# EAGLE design RasPiDV (EAGLE 6.4)
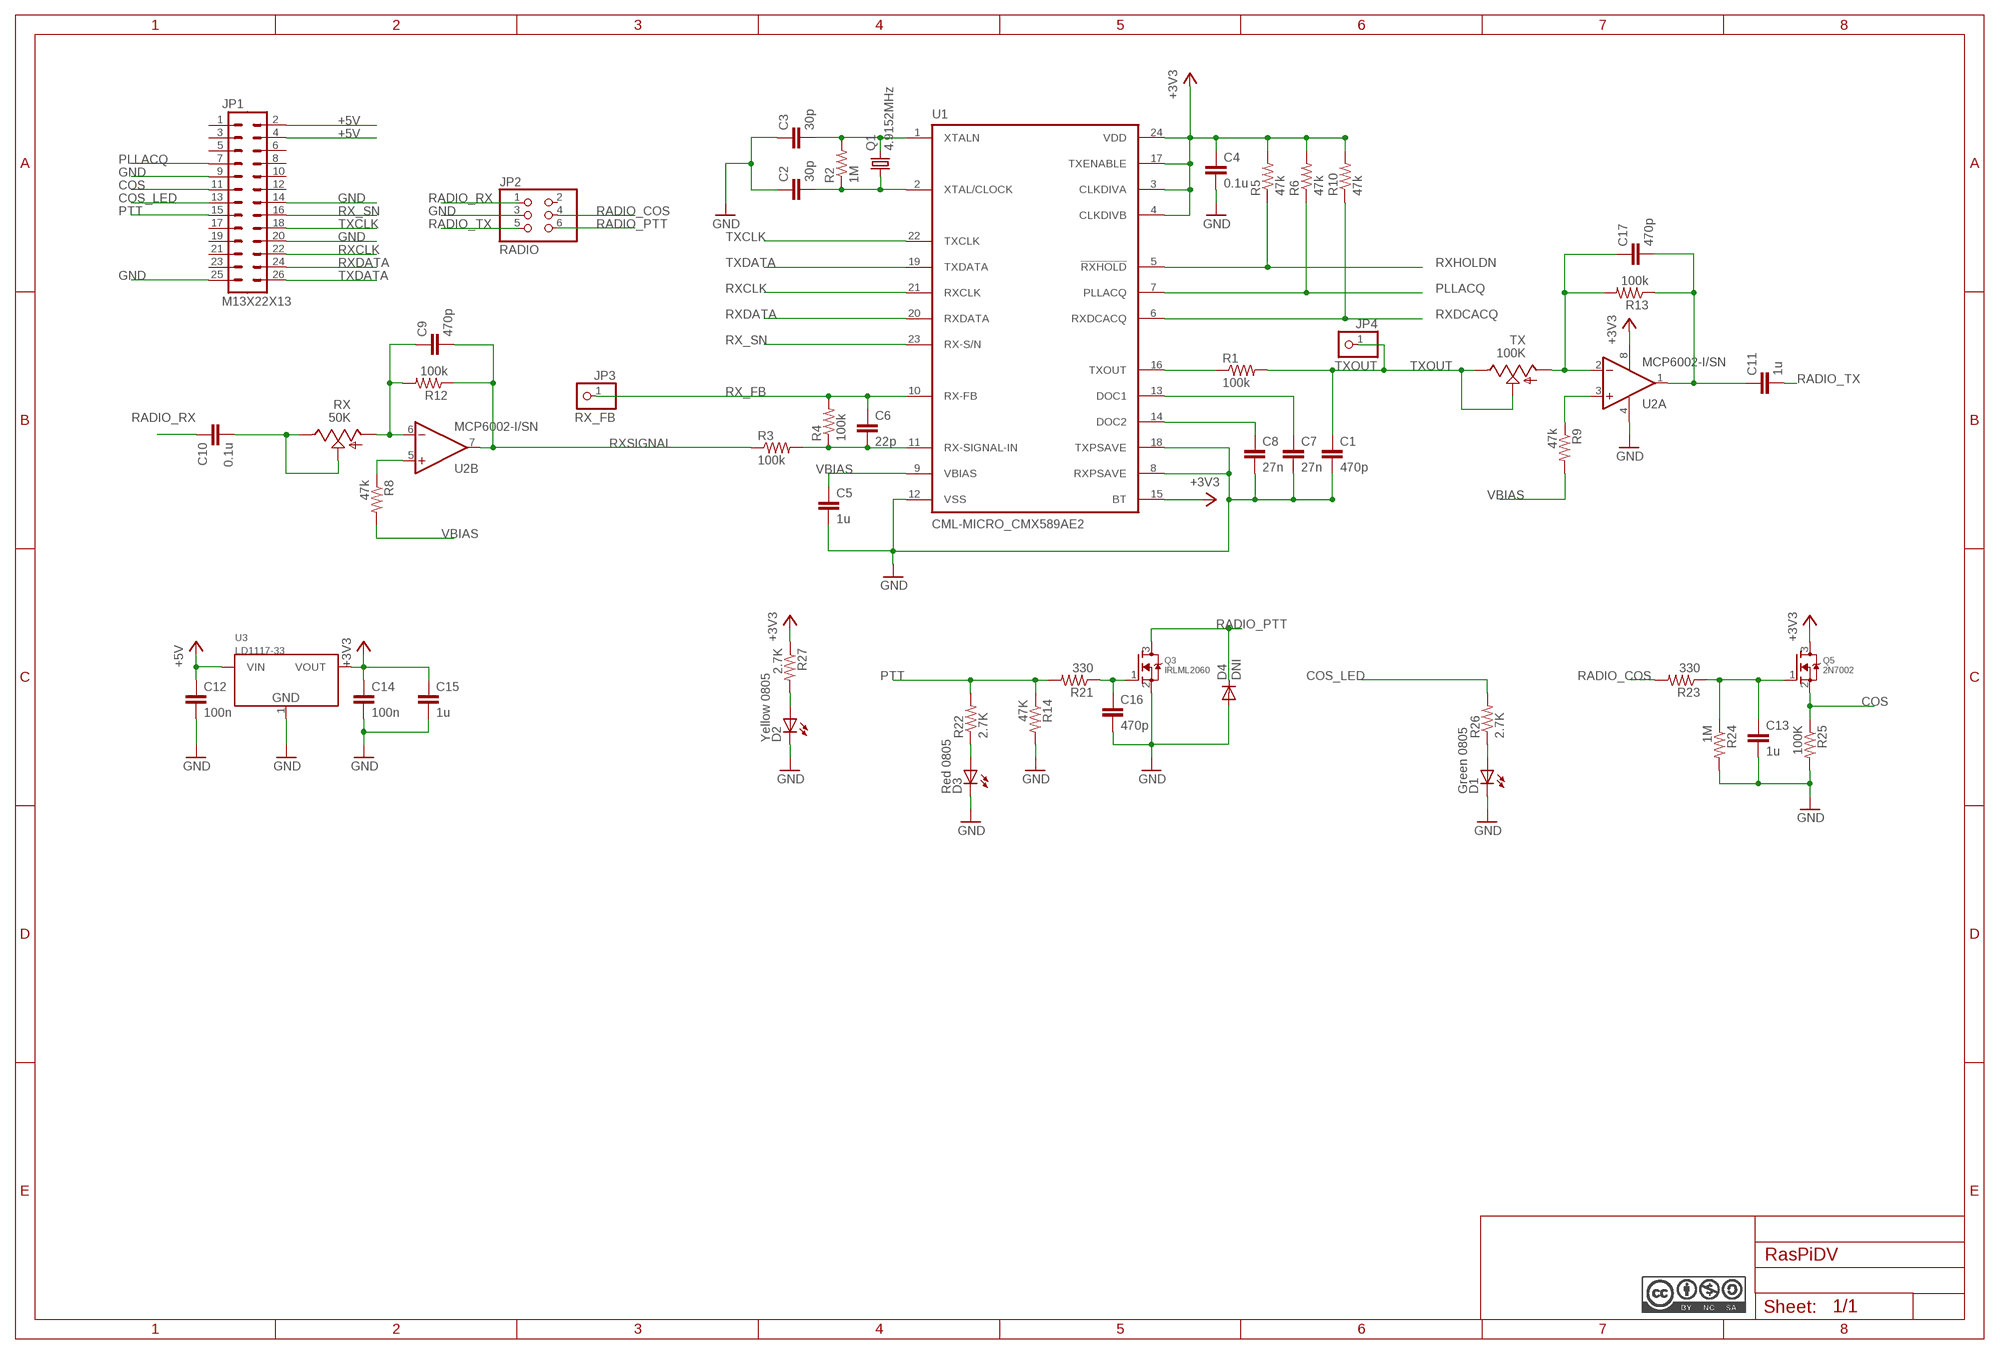
[diagram p0: schematic, sheet 1]

## Parts
C1  470p  C-EUC0805  [C0805]
C2  30p  C-EUC0805  [C0805]
C3  30p  C-EUC0805  [C0805]
C4  0.1u  C-EUC0805  [C0805]
C5  1u  C-EUC0805  [C0805]
C6  22p  C-EUC0805  [C0805]
C7  27n  C-EUC0805  [C0805]
C8  27n  C-EUC0805  [C0805]
C9  470p  C-EUC0805  [C0805]
C10  0.1u  C-EUC0805  [C0805]
C11  1u  C-EUC0805  [C0805]
C12  100n  C-EUC0805  [C0805]
C13  1u  C-EUC0805  [C0805]
C14  100n  C-EUC0805  [C0805]
C15  1u  C-EUC0805  [C0805]
C16  470p  C-EUC0805  [C0805]
C17  470p  C-EUC0805  [C0805]
D1  Green 0805  LEDCHIPLED_0805  [CHIPLED_0805]
D2  Yellow 0805  LEDCHIPLED_0805  [CHIPLED_0805]
D3  Red 0805  LEDCHIPLED_0805  [CHIPLED_0805]
D4  DNI  DIODE-MICROMELF-R  [MICROMELF-R]
JP1  M13X22X13  [2X13]
JP2  RADIO  HEADER-2X3  [2X03_ROUND_70MIL]
JP3  RX_FB  HEADER-1X1ROUND  [1X01_ROUND]
JP4  TXOUT  HEADER-1X1ROUND  [1X01_ROUND]
Q1  4.9152MHz  CRYSTAL_CRYSTALHC49S  [CRYSTAL_HC49/S]
Q3  IRLML2060  MOSFET-NREFLOW  [SOT23]
Q5  2N7002  MOSFET-NREFLOW  [SOT23-R]
R1  100k  R-US_R0805W  [R0805W]
R2  1M  R-US_R0805W  [R0805W]
R3  100k  R-US_R0805W  [R0805W]
R4  100k  R-US_R0805W  [R0805W]
R5  47k  R-US_R0805W  [R0805W]
R6  47k  R-US_R0805W  [R0805W]
R8  47k  R-US_R0805W  [R0805W]
R9  47k  R-US_R0805W  [R0805W]
R10  47k  R-US_R0805W  [R0805W]
R12  100k  R-US_R0805W  [R0805W]
R13  100k  R-US_R0805W  [R0805W]
R14  47K  R-US_R0805W  [R0805W]
R21  330  R-US_R0805W  [R0805W]
R22  2.7K  R-US_R0805W  [R0805W]
R23  330  R-US_R0805W  [R0805W]
R24  1M  R-US_R0805W  [R0805W]
R25  100K  R-US_R0805W  [R0805W]
R26  2.7K  R-US_R0805W  [R0805W]
R27  2.7K  R-US_R0805W  [R0805W]
RX  50K  TRIM_US-B25P  [B25P]
TX  100K  TRIM_US-B25P  [B25P]
U1  CML-MICRO_CMX589AE2  AIS_MK2_CML-MICRO_CMX589AE2  [AIS_MK2_CML-MICRO_TSSOP24]
U2  MCP6002-I/SN  [SOIC-8]
U3  LD1117-33  LD1117-3.3SOT223  [SOT223]

## Nets
+3V3 [pwr]: C4.1 C14.1 C15.1 Q5.3(D) R5.2 R6.2 R10.2 R27.1 U1.3(CLKDIVA) U1.4(CLKDIVB) U1.15(BT) U1.17(TXENABLE) U1.24(VDD) U2.8(P:V+) U3.2(VOUT)
+5V [pwr]: C12.1 JP1.2 JP1.4 U3.3(VIN)
COS: JP1.11 Q5.2(S) R25.1
COS_LED: JP1.13 R26.2
GND [pwr]: C1.2 C2.1 C3.1 C4.2 C5.2 C7.2 C8.2 C12.2 C13.2 C14.2 C15.2 C16.2 D1.C D2.C D3.C D4.A JP1.9 JP1.14 JP1.20 JP1.25 JP2.3 Q3.2(S) R14.2 R24.2 R25.2 U1.8(RXPSAVE) U1.12(VSS) U1.18(TXPSAVE) U2.4(P:V-) U3.1(GND)
N$1: C13.1 Q5.1(G) R23.1 R24.1
N$2: D1.A R26.1
N$3: C10.2 RX.E RX.S
N$4: C8.1 U1.14(DOC2)
N$5: C7.1 U1.13(DOC1)
N$6: C6.2 R3.2 R4.1 U1.11(RX-SIGNAL-IN)
N$7: C9.1 R12.2 RX.A U2.6(B:IN-)
N$9: C2.2 Q1.1 R2.1 U1.2(XTAL/CLOCK)
N$10: C3.2 Q1.2 R2.2 U1.1(XTALN)
N$11: R8.1 U2.5(B:IN+)
N$12: R1.1 U1.16(TXOUT)
N$15: C11.1 C17.2 R13.1 U2.1(A:OUT)
N$16: D2.A R27.2
N$20: R9.1 U2.3(A:IN+)
N$24: C16.1 Q3.1(G) R21.1
N$28: C17.1 R13.2 TX.A U2.2(A:IN-)
N$33: D3.A R22.1
PLLACQ: JP1.7 R6.1 U1.7(PLLACQ)
PTT: JP1.15 R14.1 R21.2 R22.2
RADIO_COS: JP2.4 R23.2
RADIO_PTT: D4.C JP2.6 Q3.3(D)
RADIO_RX: C10.1 JP2.1
RADIO_TX: C11.2 JP2.5
RX_FB: C6.1 JP3.1 R4.2 U1.10(RX-FB)
RX_SN: JP1.16 U1.23(RX-S/N)
RXCLK: JP1.22 U1.21(RXCLK)
RXDATA: JP1.24 U1.20(RXDATA)
RXDCACQ: R10.1 U1.6(RXDCACQ)
RXHOLDN: R5.1 U1.5(!RXHOLD!)
RXSIGNAL: C9.2 R3.1 R12.1 U2.7(B:OUT)
TXCLK: JP1.18 U1.22(TXCLK)
TXDATA: JP1.26 U1.19(TXDATA)
TXOUT: C1.1 JP4.1 R1.2 TX.E TX.S
VBIAS: C5.1 R8.2 R9.2 U1.9(VBIAS)
Unconnected: JP1.1 JP1.3 JP1.5 JP1.6 JP1.8 JP1.10 JP1.12 JP1.17 JP1.19 JP1.21 JP1.23 JP2.2

## Library data of the parts
C1-C17 = resistor:C-EU: CAPACITOR, European symbol
D1-D3 = adafruit:LED: LED OSRAM: - CHIPLED LG R971, LG N971, LY N971, LG Q971, LY Q971, LO R971, LY R971 LH N974, LH R974 LS Q976, LO Q976, LY Q976 LO Q996 - Hyper CHIPLED LW Q18S LB Q993, LB Q99A, LB R99A - SideLED LS A670, LO A670, LY A670, LG A670, LP A670 LB A673, LV A673, LT A673, LW A673 LH A674 LY A675 LS A676, LA A676, LO A676, LY A676, LW A676 LS A679, LY A679, LG A679 - Hyper Micro SIDELED® LS Y876, LA Y876, LO Y876, LY Y876 LT Y87S - SmartLED LW L88C, LW L88S LB L89C, LB L89S, LG L890 LS L89K, LO L89K, LY L89K LS L896, LA L896, LO L896, LY L896 - TOPLED LS T670, LO T670, LY T670, LG T670, LP T670 LSG T670, LSP T670, LSY T670, LOP T670, LYG T670 LG T671, LOG T671, LSG T671 LB T673, LV T673, LT T673, LW T673 LH T674 LS T676, LA T676, LO T676, LY T676, LB T676, LH T676, LSB T676, LW T676 LB T67C, LV T67C, LT T67C, LS T67K, LO T67K, LY T67K, LW E67C LS E67B, LA E67B, LO E67B, LY E67B, LB E67C, LV E67C, LT E67C LW T67C LS T679, LY T679, LG T679 LS T770, LO T770, LY T770, LG T770, LP T770 LB T773, LV T773, LT T773, LW T773 LH T774 LS E675, LA E675, LY E675, LS T675 LS T776, LA T776, LO T776, LY T776, LB T776 LHGB T686 LT T68C, LB T68C - Hyper Mini TOPLED® LB M676 - Mini TOPLED Santana® LG M470 LS M47K, LO M47K, LY M47K Source: http://www.osram.convergy.de/
D4 = diode:DIODE-: DIODE
JP1 = SparkFun-Connectors:M13X2: 0.1" spaced headers
JP2 = microbuilder:HEADER-2X3: PIN HEADER
JP3 JP4 = microbuilder:HEADER-1X1: PIN HEADER
Q1 = AIS_Mk2:CRYSTAL_CRYSTAL: CRYSTAL
Q3 = adafruit:MOSFET-N: N-Channel Mosfet 2N7002E - 60V 260mA SOT23 [Digikey: 2N7002ET1GOSTR-ND] - REEL BSH103 - 30V 850mA SOT23 [Digikey: 568-5013-1-ND]
Q5 = microbuilder:MOSFET-N: N-Channel Mosfet LEGEND VDS: Voltage Drain-Source ID: Drain Current RDS(ON): Drain-Source On-State Resistance VGS(TH): Gate-Source Threshold Voltage CISS: Drain-Source Input Capacitance SOT-23 Name VDS ID RDS(ON) VGS(TH) CISS Order Number 2N7002E 60V 260mA 2.5 Ohm 2.5V @ 250uA 26.7pF @ 25V 2N7002ET1GOSTR-ND BSH103 30V 850mA 400 mOhm 400mV @ 1mA 83pF @ 24V BSH103,235-ND BSS138 60V 320mA 1.6 Ohm 1.5V @ 250uA 50pF @ 10V Mouser: 771-BSS138PW115 DMN2075U-7 20V 4.2A 38 mOhm 1V @ 250 uA 594.3pF @ 10V DMN2075U-7DICT-ND * BSS138 good choice for I2C level-shifting
R1-R6 R8-R10 R12-R14 R21-R27 = resistor:R-US_: RESISTOR, American symbol
RX TX = pot:TRIM_US-: POTENTIOMETER
U1 = 12_dollar:AIS_MK2_CML-MICRO_CMX589A: HIGH-SPEED GMSK MODEM
U2 = linear-mcp-600x:MCP6002: Dual Op Amp 1.8V to 5.5V Single Supply CMOS Source: http://ww1.microchip.com/downloads/en/DeviceDoc/21733h.pdf.
U3 = dp_devices:LD1117-3.3

## Net classes
1 pwr: width 0.381 mm

## Board
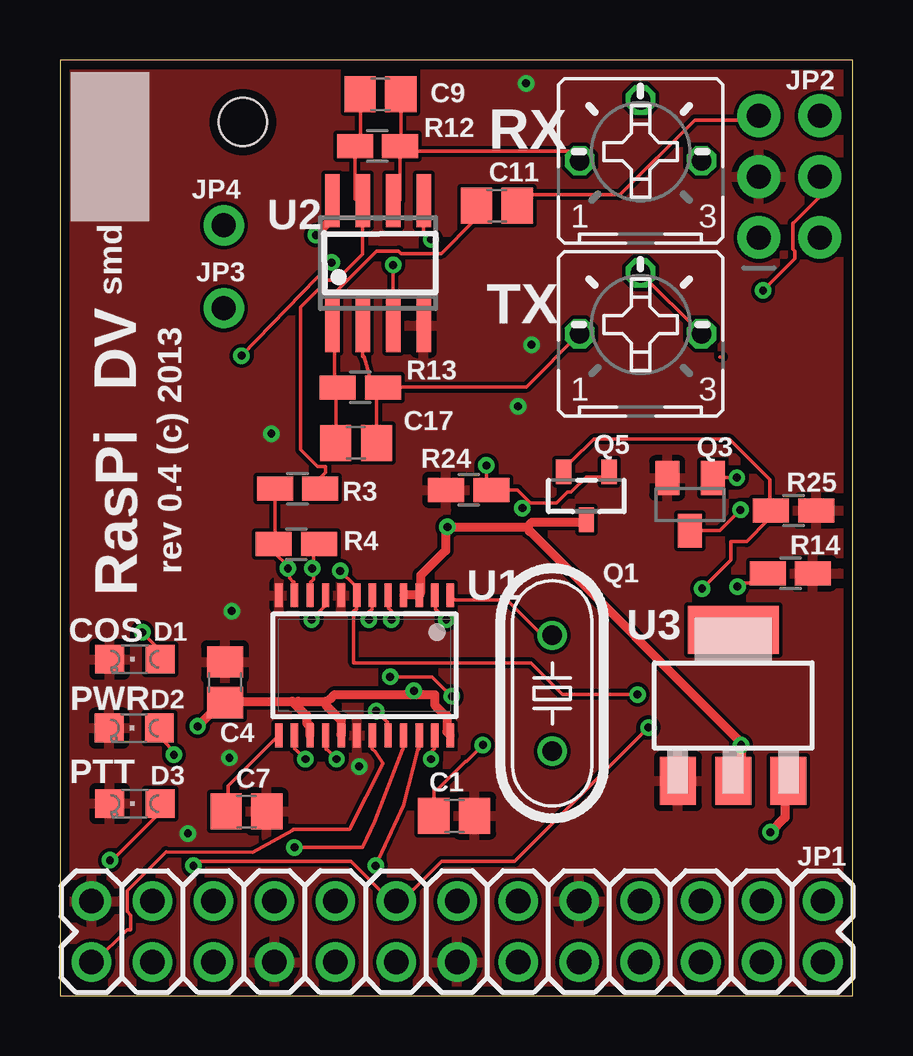
[diagram p1: board, top side]
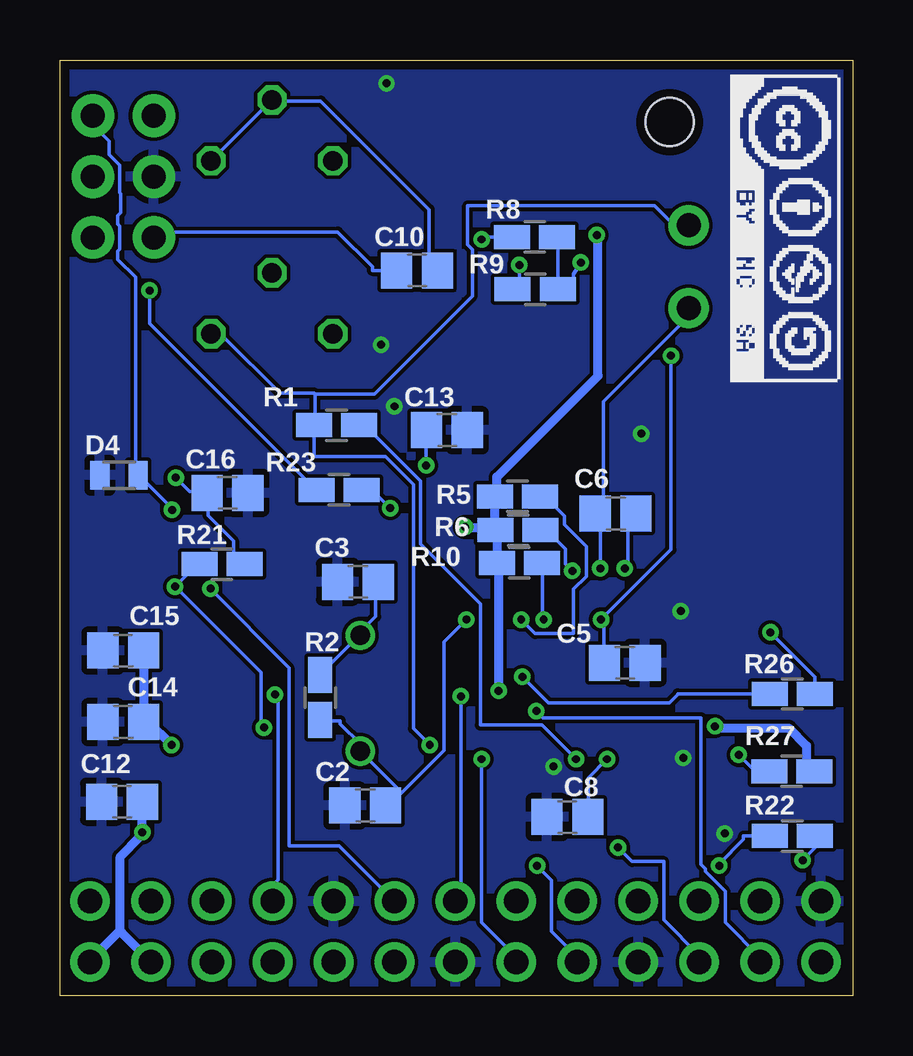
[diagram p2: board, bottom side, seen from below]

Size 33.05 x 39 mm. Coordinates in mm from the lower left corner, seen from the top.
Outline: 0,0 33.05,0 33.05,39 0,39 0,0
Copper layers (1*16): Top 0.0356mm / dielectric 1.5011mm / Bottom 0.0356mm
Design rules "LaenPCBOrder": minimum track width 6mil, minimum drill 13mil, track to track 6mil, track to pad 6mil, pad to pad 6mil, via to via 6mil, smd to smd 6mil, copper to edge 15mil, drill to drill 6mil, minimum pad ring 7mil, minimum via ring 7mil, stop-mask expansion 4mil, vias tented up to drill 0mil, thermal gap 10mil
Holes 2 mm at 7.63,36.41

### Footprints (pad centres in the part's own frame; a part is rotated, then mirrored left to right if it is on the bottom)
C0805 = smd 1.3 x 1.5: 1 -0.85,0; 2 0.85,0
CHIPLED_0805 = smd 1.2 x 1.2: A 0,-1.05; C 0,1.05
MICROMELF-R = smd 0.8 x 1.2: A 0.8,0; C -0.8,0
2X13 = drill 1.016 pad 1.651: 1 0,0; 2 0,2.54; 3 2.54,0; 4 2.54,2.54; 5 5.08,0; 6 5.08,2.54; 7 7.62,0; 8 7.62,2.54; 9 10.16,0; 10 10.16,2.54; 11 12.7,0; 12 12.7,2.54; 13 15.24,0; 14 15.24,2.54; 15 17.78,0; 16 17.78,2.54; 17 20.32,0; 18 20.32,2.54; 19 22.86,0; 20 22.86,2.54; 21 25.4,0; 22 25.4,2.54; 23 27.94,0; 24 27.94,2.54; 25 30.48,0; 26 30.48,2.54
2X03_ROUND_70MIL = drill 1 pad 1.778: 1 -2.54,1.27; 2 -2.54,-1.27; 3 0,1.27; 4 0,-1.27; 5 2.54,1.27; 6 2.54,-1.27
1X01_ROUND = drill 1 pad 1.676: 1 0,0
CRYSTAL_HC49/S = drill 0.813: 1 -2.413,0; 2 2.413,0
SOT23 = smd 1 x 1.4: 1 -0.95,-1.1; 2 0.95,-1.1; 3 0,1.1
SOT23-R = smd 0.635 x 1.016: 1 -0.95,-1; 2 0.95,-1; 3 0,1
R0805W = smd 1.5 x 1: 1 -0.94,0; 2 0.94,0
B25P = drill 0.813 octagon: A -2.54,0; E 2.54,0; S 0,2.54
AIS_MK2_CML-MICRO_TSSOP24 = smd 0.305 x 0.991: 1 -3.575,-2.918; 2 -2.925,-2.918; 3 -2.275,-2.918; 4 -1.625,-2.918; 5 -0.975,-2.918; 6 -0.325,-2.918; 7 0.325,-2.918; 8 0.975,-2.918; 9 1.625,-2.918; 10 2.275,-2.918; 11 2.925,-2.918; 12 3.575,-2.918; 13 3.575,2.918; 14 2.925,2.918; 15 2.275,2.918; 16 1.625,2.918; 17 0.975,2.918; 18 0.325,2.918; 19 -0.325,2.918; 20 -0.975,2.918; 21 -1.625,2.918; 22 -2.275,2.918; 23 -2.925,2.918; 24 -3.575,2.918
SOIC-8 = smd 0.6 x 2.2: 1 -1.905,-2.6; 2 -0.635,-2.6; 3 0.635,-2.6; 4 1.905,-2.6; 5 1.905,2.6; 6 0.635,2.6; 7 -0.635,2.6; 8 -1.905,2.6
SOT223 = smd 1.5 x 2: 1 -2.3,-3.15; 2 0,-3.15; 3 2.3,-3.15 | smd 3.8 x 2: 4 0,3.15

### Placement (x,y rotation side)
C1  16.43,7.49 0 top
C2  20.32,7.92 0 bottom
C3  20.62,17.25 0 bottom
C4  6.88,13.06 90 top
C5  9.5,13.87 0 bottom
C6  9.88,20.09 0 bottom
C7  7.77,7.67 0 top
C8  11.89,7.44 180 bottom
C9  13.36,37.57 180 top
C10  18.16,30.23 0 bottom
C11  18.21,32.92 0 top
C12  30.45,8.08 180 bottom
C13  16.92,23.57 0 bottom
C14  30.4,11.4 180 bottom
C15  30.4,14.38 180 bottom
C16  26.06,20.95 0 bottom
C17  12.34,23.04 180 top
D1  3.12,14.02 90 top
D2  3.1,11.15 90 top
D3  3.12,8 90 top
D4  30.58,21.69 180 bottom
JP1  31.8,3.93 180 top
JP2  30.4,34.14 90 top
JP3  6.83,28.65 0 top
JP4  6.83,32.11 0 top
Q1  20.52,12.6 90 top
Q3  26.26,20.47 180 top
Q5  21.95,20.83 180 top
R1  21.51,23.77 180 bottom
R2  22.2,12.42 90 bottom
R3  9.91,21.13 180 top
R4  9.86,18.82 0 top
R5  13.97,20.8 180 bottom
R6  13.94,19.41 180 bottom
R8  13.26,31.62 0 bottom
R9  13.23,29.44 0 bottom
R10  13.89,18.03 180 bottom
R12  13.23,35.41 0 top
R13  12.52,25.35 0 top
R14  30.45,17.6 0 top
R21  26.29,17.98 180 bottom
R22  2.51,6.65 180 bottom
R23  21.41,21.08 180 bottom
R24  17.04,21.08 180 top
R25  30.58,20.22 0 top
R26  2.51,12.57 180 bottom
R27  2.54,9.35 180 bottom
RX  24.21,34.8 0 top
TX  24.21,27.58 0 top
U1  12.7,13.77 180 top
U2  13.26,30.53 0 top
U3  28.07,12.09 0 top

### Tracks (layer width: path | path; a pad name or v marks a point on that pad's centre or on a via)
+3V3  (via drill 0.33)
  Top 0.381: 9.8,12.14 9.68,12.27 6.93,12.27 C4.1 6.71,12.12 6.63,12.12 v5.74,11.23 | 9.8,12.14 10.26,11.68 10.29,11.68 10.29,11.35 10.39,11.25 10.41,11.25 10.41,10.87 U1.15 | 11.07,12.27 11.07,12.12 11.68,11.51 11.71,11.51 11.71,10.87 U1.17 | 11.07,12.27 9.93,12.27 9.8,12.14 | 14.76,12.55 11.46,12.55 11.25,12.34 11.07,12.27 | 14.76,12.55 15.62,12.55 15.62,12.12 16.05,11.68 16.13,11.68 16.13,11 16.26,10.87 U1.24 | U3.2 28.07,9.73 28.19,9.73 28.4,9.93 v28.4,10.44 28.32,10.62 19.58,19.36 19.56,19.36 19.48,19.53 | U1.4 U1.3 15.04,16.87 15.04,17.53 15.06,17.53 16.08,18.54 16.08,19.36 v16.15,19.53 19.48,19.53 | 19.48,19.53 19.68,19.74 21.87,19.74 21.95,19.81 Q5.3 | U2.8 11.35,32.23 11.2,32.23 v10.67,31.7 | v14.76,12.7 14.76,12.55
  Bottom 0.381: R27.1 1.93,9.68 1.93,10.41 2.67,11.15 5.74,11.15 v5.74,11.23 | R27.1 | C15.1 29.57,14.38 29.57,11.4 C14.1 29.39,11.43 v28.4,10.44 | v16.15,19.53 16.1,19.48 14.91,19.48 14.91,19.41 R6.2 | R10.2 14.83,19.23 R6.2 | R10.2 | R5.2 14.91,19.66 R6.2 | R5.2 | v10.67,31.7 10.62,31.65 10.62,25.83 14.83,21.61 14.83,20.98 R5.2 | v14.76,12.7 14.76,17.86 R10.2
+5V  (via drill 0.33)
  Top 0.381: v29.62,6.81 30.23,7.42 30.23,8.91 30.35,8.91 U3.3
  Bottom 0.381: C12.1 29.62,8.08 v29.62,6.81 29.69,6.63 30.53,5.79 30.53,2.72 | 30.53,2.72 31.77,1.47 31.77,1.4 JP1.2 | JP1.4 30.43,2.56 30.53,2.72
COS  (via drill 0.33)
  Top 0.152: Q5.2 21.01,21.84 21.01,22.25 21.31,22.25 22.25,23.19 27.91,23.19 29.59,21.51 29.59,20.22 R25.1 29.54,20.17 29.54,19.84 28.63,18.92 27.96,18.92 27.96,18.16 v26.77,16.97
  Bottom 0.152: v26.77,16.97 26.77,16.94 23.5,13.66 23.5,6.25 21.41,6.25 JP1.11
COS_LED  (via drill 0.33)
  Top 0.152: v13.77,13.28 15.52,13.28 v16.33,12.47
  Bottom 0.152: R26.2 7.29,12.57 7.29,12.55 7.64,12.19 12.68,12.19 v13.77,13.28 | v16.33,12.47 16.33,4.67 16.54,4.47 16.54,3.94 JP1.13
GND  (via drill 0.33)
  other vias: 7.16,16.03 19.1,24.56 12.47,9.55 19.43,38.02 19.66,27.13 8.81,23.42 7.06,9.91 5.33,6.76
  pour Top: 0,38.94 33.07,38.94 33.07,0 0,0
  pour Bottom: 0,38.94 33.07,38.94 33.07,0 0,0
N$1  (via drill 0.33)
  Top 0.152: 19.56,20.6 19.07,21.08 R24.1 17.93,21.13 17.78,21.13 v17.78,22.1 | 19.56,20.6 19.63,20.52 20.7,20.52 21.16,20.98 21.31,20.98 21.95,21.61 22.68,21.61 22.89,21.82 Q5.1 | 19.56,20.6 v19.28,20.32
  Bottom 0.152: v17.78,22.1 C13.1 | R23.1 19.81,21.08 19.81,20.85 v19.28,20.32
N$2  (via drill 0.33)
  Top 0.152: v3.43,15.14 4.04,14.53 4.17,14.53 D1.A
  Bottom 0.152: v3.43,15.14 1.57,13.28 R26.1 | R26.1
N$3
  Bottom 0.152: C10.2 17.32,30.23 17.65,30.56 17.65,32.77 22.17,37.29 24.21,37.29 RX.S RX.E
N$4  (via drill 0.33)
  Top 0.152: v10.24,9.86 9.8,10.29 9.78,10.29 U1.14
  Bottom 0.152: v10.24,9.86 11.02,9.07 11.02,7.44 C8.1
N$5
  Top 0.152: C7.1 7.01,7.67 7.01,8.74 U1.13
N$6  (via drill 0.33)
  Top 0.152: 9.55,17.86 8.91,18.49 R4.1 | 9.55,17.86 9.58,17.83 9.58,17.4 9.73,17.25 9.75,17.25 9.75,16.69 U1.11 | R4.1 | R3.2 8.97,18.87 R4.1 | R3.2 | v9.5,17.8 9.55,17.86
  Bottom 0.152: v9.5,17.8 9.37,17.93 9.37,19.76 9.04,20.09 C6.2
N$7
  Top 0.152: R12.2 14.17,33.15 13.89,33.15 U2.6 | R12.2 | C9.1 14.22,37.57 14.22,35.46 R12.2 | RX.A 21.26,35.2 14.22,35.2 R12.2
N$9  (via drill 0.33)
  Top 0.152: v16.1,15.67 15.67,16.1 15.65,16.1 15.65,16.66 U1.2
  Bottom 0.152: R2.1 22.2,11.46 21.36,11.46 21.36,11.33 20.52,10.49 Q1.1 18.9,8.56 18.9,8.46 C2.2 19.33,7.92 17.04,10.21 17.04,14.73 v16.1,15.67
N$10
  Top 0.152: Q1.2 20.12,15.01 18.64,16.48 16.46,16.48 16.28,16.66 U1.1
  Bottom 0.152: R2.2 22.2,13.39 20.57,15.01 Q1.2 20.47,15.06 20.47,15.21 19.89,15.8 19.89,17.14 19.79,17.25 C3.2
N$11  (via drill 0.33)
  Top 0.152: v15.47,31.52 15.16,31.83 U2.5
  Bottom 0.152: R8.1 15.47,31.62 v15.47,31.52
N$12  (via drill 0.33)
  Top 0.152: v11.53,9.86 11.12,10.26 11.1,10.26 11.1,10.85 U1.16
  Bottom 0.152: v11.53,9.86 12.95,11.28 15.52,11.28 15.52,16.33 18.01,18.82 18.01,21.44 20.34,23.77 R1.1
N$15
  Top 0.152: C17.2 11.51,23.04 11.51,25.35 R13.1 11.46,25.4 11.46,27.89 11.43,27.89 U2.1 11.38,27.94 11.38,29.21 13.21,31.04 14.12,31.04 14.22,30.94 15.9,30.94 17.22,32.26 17.35,32.26 17.35,32.92 C11.1
N$16  (via drill 0.33)
  Top 0.152: v4.75,10.03 4.75,10.19 4.29,10.64 4.17,10.64 4.17,11.15 D2.A
  Bottom 0.152: v4.75,10.03 4.06,9.35 R27.2
N$19
  Top 0.152: 27.64,26.62 27.5,26.62
N$20  (via drill 0.33)
  Top 0.152: U2.3 v13.89,30.45
  Bottom 0.152: R9.1 13.89,29.72 v13.89,30.45 | R9.1
N$24  (via drill 0.33)
  Top 0.152: v28.22,21.59 27.23,21.59 Q3.1
  Bottom 0.152: v28.22,21.59 27.64,21.01 26.92,21.01 26.92,20.95 C16.1 26.87,20.9 26.87,20.02 25.81,18.95 25.81,18.44 R21.1 | R21.1
N$28
  Top 0.152: R13.2 13.21,25.35 13.21,23.04 C17.1 | U2.2 12.62,26.64 12.68,26.64 12.78,26.29 13.01,25.4 13.16,25.4 R13.2 | TX.A 19.46,25.38 13.54,25.38 R13.2
N$33  (via drill 0.33)
  Top 0.152: v2.08,5.64 2.18,5.64 4.04,7.49 4.17,7.49 D3.A
  Bottom 0.152: v2.08,5.64 1.57,6.15 R22.1 | R22.1
PLLACQ  (via drill 0.33)
  Top 0.152: v11.68,17.7 12.29,17.09 12.37,17.09 U1.7 12.37,16.61 12.37,16.1 12.32,16.1 12.24,16.03 12.24,13.87 19.63,13.87 20.95,12.55 v24.08,12.55
  Bottom 0.152: v11.68,17.7 11.96,17.98 11.96,18.62 12.75,19.41 R6.1 | v24.08,12.55 23.95,12.42 23.95,4.83 24.16,4.62 24.16,3.94 JP1.7
PTT  (via drill 0.33)
  Top 0.152: v28.25,17.04 28.4,17.2 29.08,17.2 29.49,17.6 R14.1 | v5.56,5.41 5.74,5.59 12.14,5.59 13.79,3.94 13.99,3.94 JP1.15 14.1,3.94 14.25,3.94 15.9,5.59 18.95,5.59 v24.54,11.18
  Bottom 0.152: R21.2 27.3,17.98 v28.25,17.04 24.66,13.46 24.66,11.3 v24.54,11.18 | R22.2 4.55,6.66 4.55,6.5 5.56,5.49 v5.56,5.41
RADIO_COS  (via drill 0.33)
  Top 0.152: v29.31,29.39 30.63,30.71 30.63,31.04 30.56,31.11 30.56,32.21 30.58,32.21 31.67,33.3 JP2.4
  Bottom 0.152: v29.31,29.39 29.31,28.02 22.38,21.08 R23.2
RADIO_PTT  (via drill 0.33)
  Top 0.152: v28.37,20.24 27.51,19.38 Q3.3
  Bottom 0.152: v28.37,20.24 28.37,20.3 29.77,21.69 D4.C 29.82,21.74 29.9,21.82 29.9,29.95 30.63,30.68 30.63,31.04 30.56,31.11 30.56,32.08 30.63,32.16 30.63,32.51 30.5,32.64 30.5,33.43 30.56,33.48 30.56,34.62 30.99,35.05 30.99,35.61 31.67,36.3 JP2.6
RADIO_RX
  Bottom 0.152: C10.1 20.02,30.23 20.02,30.38 21.46,31.83 29.13,31.83 JP2.1
RADIO_TX
  Top 0.152: JP2.5 28.47,36.68 28.3,36.5 26.47,36.5 23.34,33.38 19.53,33.38 19.07,32.92 C11.2
RX_FB  (via drill 0.33)
  Top 0.152: 10.57,17.8 10.57,18.82 R4.2 | 10.57,17.8 10.57,17.35 10.46,17.25 10.44,17.25 10.44,16.69 U1.10 | v10.52,17.8 10.57,17.8
  Bottom 0.152: v10.52,17.8 10.52,19.89 10.72,20.09 C6.1 10.67,20.14 10.39,20.42 10.39,24.77 6.83,28.32 JP3.1
RX_SN  (via drill 0.33)
  Top 0.152: v15.47,9.86 15.47,10.16 15.6,10.29 15.62,10.29 U1.23
  Bottom 0.152: v15.47,9.86 15.47,3.05 14.02,1.6 JP1.16
RXCLK  (via drill 0.33)
  Top 0.152: v9.78,6.17 12.62,6.17 13.11,7.24 14.28,10.26 14.3,10.26 14.3,10.85 U1.21
  Bottom 0.152: v9.78,6.17 9.2,5.59 7.87,5.59 7.87,3.15 6.4,1.68 JP1.22
RXDATA  (via drill 0.33)
  Top 0.152: v13.18,11.86 13.64,11.4 13.66,11.4 13.66,10.87 U1.20
  Bottom 0.152: v13.18,11.86 12.9,11.58 6.33,11.58 6.33,5.46 6.15,5.28 6.15,5.18 5.31,4.34 5.31,3.05 3.86,1.6 JP1.24
RXDCACQ  (via drill 0.33)
  Top 0.152: v12.88,15.67 12.88,16 12.98,16.1 13.01,16.1 13.01,16.66 U1.6
  Bottom 0.152: v12.88,15.67 12.93,15.72 12.93,18.03 R10.1
RXHOLDN  (via drill 0.33)
  Top 0.152: v13.82,15.67 13.82,16.03 13.72,16.13 13.69,16.13 13.69,16.66 U1.5
  Bottom 0.152: v13.82,15.67 13.23,15.09 11.63,15.09 11.63,16.94 11.1,17.48 11.1,18.72 12.01,19.63 12.01,19.99 12.83,20.8 R5.1
RXSIGNAL
  Top 0.152: R3.1 10.87,21.13 10.87,21.59 11.07,21.79 11.07,22.05 10.74,22.05 10.03,22.76 10.03,28.7 11.15,29.82 11.53,29.82 12.62,30.91 U2.7 12.6,33.2 12.29,33.2 R12.1 12.34,35.46 12.52,35.46 12.52,37.57 C9.2
TXCLK  (via drill 0.33)
  Top 0.152: v13.16,5.41 14.33,7.92 14.94,10.29 14.96,10.29 U1.22
  Bottom 0.152: v13.16,5.41 12.55,4.8 12.55,2.67 11.48,1.6 JP1.18
TXDATA
  Top 0.152: U1.19 13.01,10.85 13.01,10.29 13.16,10.16 13.18,10.11 13.46,9.68 12.06,6.93 9.73,6.93 9.7,6.88 8.03,5.97 4.42,5.99 2.79,4.37 2.79,3.5 2.95,3.35 2.95,2.74 2.79,2.74 1.45,1.4 JP1.26
TXOUT  (via drill 0.33)
  Top 0.152: TX.S TX.E | v17.63,10.44 16.94,9.75 16.92,9.75 15.75,8.59 15.6,8.59 15.6,7.49 C1.1
  Bottom 0.152: v17.63,10.44 18.31,11.12 18.31,21.31 19.48,22.48 22.45,22.48 R1.2 | R1.2 | JP4.1 7.57,32.11 7.57,32.23 8.26,32.92 16.05,32.92 16.05,31.29 15.85,31.09 15.85,29.16 19.94,25.07 22.4,25.07 | 22.4,25.07 22.4,23.82 R1.2 | TX.E 26.21,27.58 26.21,27.46 23.88,25.12 22.45,25.12 22.4,25.07
VBIAS  (via drill 0.33)
  Top 0.152: v10.49,15.67 11.05,16.23 11.07,16.23 11.07,16.66 U1.9 | v7.57,26.67 v11.33,30.56
  Bottom 0.152: R8.2 12.29,31.62 R9.2 12.24,29.84 11.63,29.84 11.63,30.07 v11.33,30.56 | C5.1 10.36,13.87 10.36,15.54 v10.49,15.67 7.57,18.59 v7.57,26.67

### Text on the board
tNames: smd | DV | rev 0.4 (c) 2013 | RasPi | COS | PWR | PTT